# Altium project model_satellite.PrjPCB
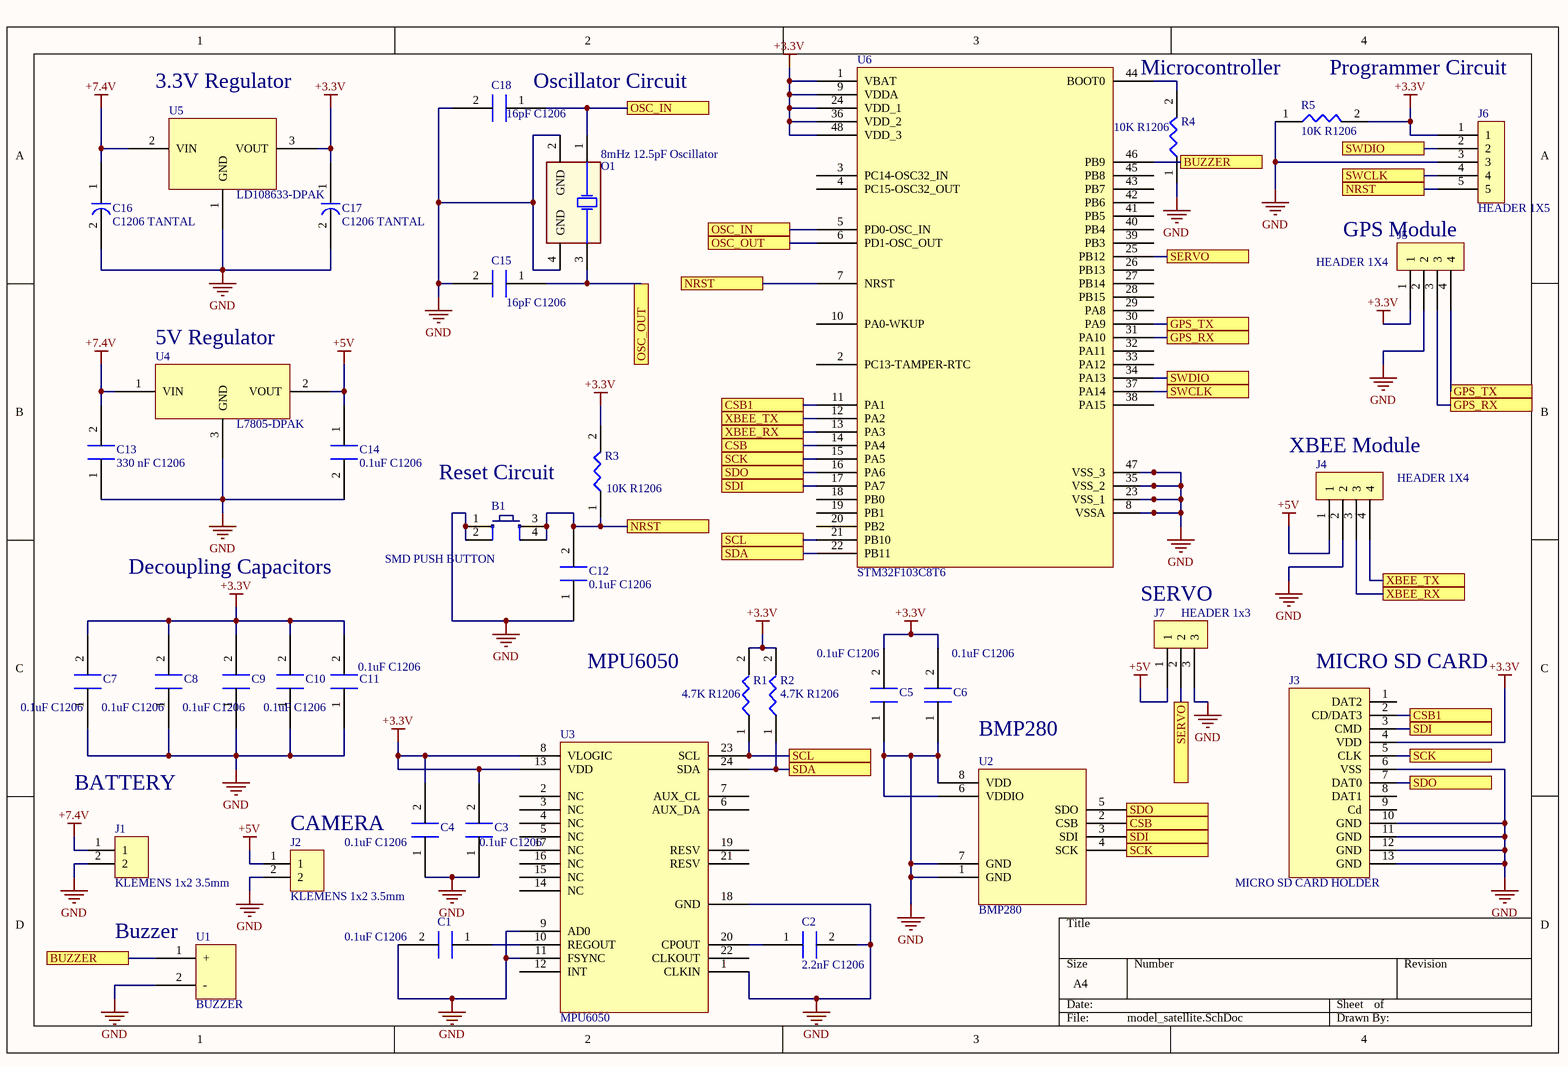
[diagram p0: model_satellite.SchDoc]
1 sheet, 38 parts. Net scope: flat (ports and power ports of the same name join across sheets).
Board file: model_satellite.PcbDoc

## Sheet model_satellite.SchDoc
size A4

### Parts
B1  SMD PUSH BUTTON  [SMD PUSH BUTTON]
C1  0.1uF C1206  [C1206]
C2  2.2nF C1206  [C1206]
C3  0.1uF C1206  [C1206]
C4  0.1uF C1206  [C1206]
C5  0.1uF C1206  [C1206]
C6  0.1uF C1206  [C1206]
C7  0.1uF C1206  [C1206]
C8  0.1uF C1206  [C1206]
C9  0.1uF C1206  [C1206]
C10  0.1uF C1206  [C1206]
C11  0.1uF C1206  [C1206]
C12  0.1uF C1206  [C1206]
C13  330 nF C1206  [C1206]
C14  0.1uF C1206  [C1206]
C15  16pF C1206  [C1206]
C16  C1206 TANTAL  [C1206-TANTAL]
C17  C1206 TANTAL  [C1206-TANTAL]
C18  16pF C1206  [C1206]
J1  KLEMENS 1x2 3.5mm  [Klemens 1X2 3.5mm]
J2  KLEMENS 1x2 3.5mm  [Klemens 1X2 3.5mm]
J3  MICRO SD CARD HOLDER  [MICRO_SDCARD]
J4  HEADER 1X4  [Header 2.54 1x4]
J5  HEADER 1X4  [Header 2.54 1x4]
J6  HEADER 1X5  [Header 2.54 1x5]
J7  HEADER 1x3  [Header 2.54 1x3]
O1  8mHz 12.5pF Oscillator  [8mHz Oscillator]
R1  4.7K R1206  [R1206]
R2  4.7K R1206  [R1206]
R3  10K R1206  [R1206]
R4  10K R1206  [R1206]
R5  10K R1206  [R1206]
U1  BUZZER  [BUZZER]
U2  BMP280  [BMP280]
U3  MPU6050  [QFN50P400X400X95_HS-25N]
U4  L7805-DPAK  [L7805]
U5  LD108633-DPAK  [L7805]
U6  STM32F103C8T6  [LQFP48-STM32F103CB6T]

### Ports
BUZZER, CSB, CSB1, GPS_RX, GPS_TX, NRST, OSC_IN, OSC_OUT, SCK, SCL, SDA, SDI, SDO, SERVO, SWCLK, SWDIO, XBEE_RX, XBEE_TX

### Nets
+3.3V: C3.2 C4.2 C5.2 C6.2 C7.2 C8.2 C9.2 C10.2 C11.2 C17.1 J3.4(VDD) J5.1 J6.1 R1.2 R2.2 R3.2 R5.2 U3.8(VLOGIC) U3.13(VDD) U5.3(VOUT) U6.1(VBAT) U6.9(VDDA) U6.24(VDD_1) U6.36(VDD_2) U6.48(VDD_3)
+5V: C14.1 J2.1 J4.1 J7.1 U4.2(VOUT)
+7.4V: C13.2 C16.1 J1.1 U4.1(VIN) U5.2(VIN)
GND: B1.1 B1.2 C1.2 C2.2 C3.1 C4.1 C5.1 C6.1 C7.1 C8.1 C9.1 C10.1 C11.1 C12.1 C13.1 C14.2 C15.2 C16.2 C17.2 C18.2 J1.2 J2.2 J3.6(VSS) J3.10(GND) J3.11(GND) J3.12(GND) J3.13(GND) J4.2 J5.2 J6.3 J7.3 O1.2(GND) O1.4(GND) R4.1 R5.1 U1.2(-) U2.1(GND) U2.6(VDDIO) U2.7(GND) U2.8(VDD) U3.1(CLKIN) U3.9(AD0) U3.11(FSYNC) U3.18(GND) U4.3(GND) U5.1(GND) U6.8(VSSA) U6.23(VSS_1) U6.35(VSS_2) U6.47(VSS_3)
NetB1_3: B1.3 B1.4 C12.2 J6.5 R3.1 U6.7(NRST) ; port NRST
NetC1_1: C1.1 U3.10(REGOUT)
NetC2_1: C2.1 U3.20(CPOUT)
NetC15_1: C15.1 O1.3 U6.6(PD1-OSC_OUT) ; port OSC_OUT
NetC18_1: C18.1 O1.1 U6.5(PD0-OSC_IN) ; port OSC_IN
NetJ3_2: J3.2(CD/DAT3) U6.11(PA1) ; port CSB1
NetJ3_3: J3.3(CMD) U2.3(SDI) U6.17(PA7) ; port SDI
NetJ3_5: J3.5(CLK) U2.4(SCK) U6.15(PA5) ; port SCK
NetJ3_7: J3.7(DAT0) U2.5(SDO) U6.16(PA6) ; port SDO
NetJ4_3: J4.3 U6.13(PA3) ; port XBEE_RX
NetJ4_4: J4.4 U6.12(PA2) ; port XBEE_TX
NetJ5_3: J5.3 U6.31(PA10) ; port GPS_RX
NetJ5_4: J5.4 U6.30(PA9) ; port GPS_TX
NetJ6_2: J6.2 U6.34(PA13) ; port SWDIO
NetJ6_4: J6.4 U6.37(PA14) ; port SWCLK
NetJ7_2: J7.2 U6.25(PB12) ; port SERVO
NetR1_1: R1.1 U3.23(SCL) U6.21(PB10) ; port SCL
NetR2_1: R2.1 U3.24(SDA) U6.22(PB11) ; port SDA
NetR4_2: R4.2 U6.44(BOOT0)
NetU1_1: U1.1(+) U6.46(PB9) ; port BUZZER
NetU2_2: U2.2(CSB) U6.14(PA4) ; port CSB

Not connected (* = marked no-connect by the designer): J3 1(DAT2) 8(DAT1) 9(Cd); U3 2(NC) 3(NC) 4(NC) 5(NC) 6(AUX_DA) 7(AUX_CL) 12(INT) 14(NC) 15(NC) 16(NC) 17(NC) 19(RESV) 21(RESV) 22(CLKOUT); U6 2(PC13-TAMPER-RTC) 3(PC14-OSC32_IN) 4(PC15-OSC32_OUT) 10(PA0-WKUP) 18(PB0) 19(PB1) 20(PB2) 26(PB13) 27(PB14) 28(PB15) 29(PA8) 32(PA11) 33(PA12) 38(PA15) 39(PB3) 40(PB4) 41(PB5) 42(PB6) 43(PB7) 45(PB8)

### Notes on the sheet
- 3.3V Regulator
- (near C18) Oscillator Circuit
- Microcontroller
- Programmer Circuit
- GPS Module
- (near U4) 5V Regulator
- (near J4) XBEE Module
- (near R3) Reset Circuit
- Decoupling Capacitors
- SERVO
- MPU6050
- (near J3) MICRO SD CARD
- BMP280
- BATTERY
- (near J2) CAMERA
- (near U1) Buzzer

### Library data of the parts
J1 J2 = KLEMENS 1x2 3.5mm: 1x2 3.5mm Klemens
J4 J5 = HEADER 1X4: 2.54mm 1x4 Header
J6 = HEADER 1X5: 2.54mm 1x5 Header
J7 = HEADER 1x3: 1x3 2.54mm Header
U1 = BUZZER: Buzzer 5V 5mm
U2 = BMP280: BMP280 DIGITAL PRESSURE SENSOR
U3 = MPU6050: MPU6050 GYRO SENSOR
U4 = L7805-DPAK: L7805 5V REGULATOR
U5 = LD108633-DPAK: LD108633 3.3V REGULATOR
U6 = STM32F103C8T6: STM32F103C876 MICROCONTROLLER
B1 = SMD PUSH BUTTON: Satın Alma Linki: https://urun.n11.com/diger/mini-pushbutton-switch-smd-P227461537?gclid=Cj0KCQjwkoDmBRCcARIsAG3xzl8Y_-jeD7HocNM6lvuZ_rVp83568XPGtNzlPwXWLph8oCRqo0yh87UaApZYEALw_wcB&gclsrc=aw.ds